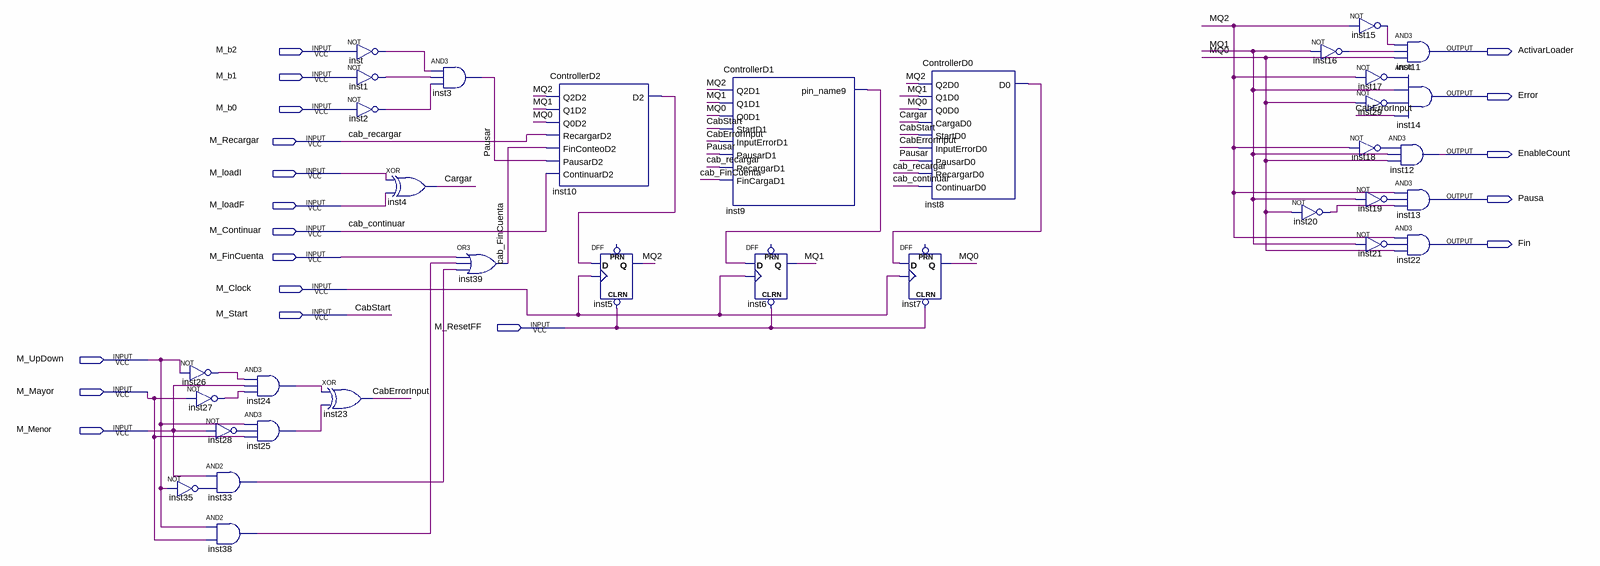
[diagram p0: schematic sheet]
// Quartus schematic ModuloControlador.bdf as structural Verilog: 34 symbols, 19 pins
module ModuloControlador (
  input  M_b2,
  input  M_b1,
  input  M_b0,
  input  M_Recargar,
  input  M_loadI,
  input  M_loadF,
  input  M_Continuar,
  input  M_FinCuenta,
  input  M_Clock,
  input  M_Start,
  input  M_ResetFF,
  input  M_UpDown,
  input  M_Mayor,
  input  M_Menor,
  output ActivarLoader,
  output Error,
  output EnableCount,
  output Pausa,
  output Fin
);

  wire cab_FinCuenta, CabErrorInput, Cargar, inst1_out, inst2_out, inst8_d0, inst9_pin_name9, inst10_d2,
       inst15_out, inst16_out, inst17_out, inst18_out, inst19_out, inst20_out, inst21_out, inst24_out,
       inst25_out, inst26_out, inst27_out, inst28_out, inst29_out, inst33_out, inst35_out, inst38_out,
       inst_out, MQ0, MQ1, MQ2, Pausar;

  not inst26 (inst26_out, M_UpDown);
  not inst27 (inst27_out, M_Mayor);
  not inst28 (inst28_out, M_Menor);
  and inst33 (inst33_out, M_Menor, inst35_out);
  not inst35 (inst35_out, M_UpDown);
  and inst38 (inst38_out, M_UpDown, M_Mayor);
  and inst24 (inst24_out, inst26_out, M_Menor, inst27_out);
  and inst25 (inst25_out, M_UpDown, inst28_out, M_Mayor);
  not inst (inst_out, M_b2);
  not inst1 (inst1_out, M_b1);
  not inst2 (inst2_out, M_b0);
  xor inst23 (CabErrorInput, inst24_out, inst25_out);
  xor inst4 (Cargar, M_loadI, M_loadF);
  and inst3 (Pausar, inst_out, inst1_out, inst2_out);
  or inst39 (cab_FinCuenta, M_FinCuenta, inst38_out, inst33_out);
  ControllerD2 inst10 (
    .Q2D2(MQ2), .Q1D2(MQ1), .Q0D2(MQ0), .RecargarD2(M_Recargar), .FinConteoD2(cab_FinCuenta),
    .PausarD2(Pausar), .ContinuarD2(M_Continuar), .D2(inst10_d2));
  DFF inst5 (.CLRN(M_ResetFF), .CLK(M_Clock), .D(inst10_d2), .Q(MQ2));  // open: PRN
  ControllerD1 inst9 (
    .Q2D1(MQ2), .Q1D1(MQ1), .Q0D1(MQ0), .StartD1(M_Start), .InputErrorD1(CabErrorInput), .PausarD1(Pausar),
    .RecargarD1(M_Recargar), .FinCargaD1(cab_FinCuenta), .pin_name9(inst9_pin_name9));
  DFF inst6 (.CLRN(M_ResetFF), .CLK(M_Clock), .D(inst9_pin_name9), .Q(MQ1));  // open: PRN
  ControllerD0 inst8 (
    .Q2D0(MQ2), .Q1D0(MQ1), .Q0D0(MQ0), .CargaD0(Cargar), .StartD0(M_Start), .InputErrorD0(CabErrorInput),
    .PausarD0(Pausar), .RecargarD0(M_Recargar), .ContinuarD0(M_Continuar), .D0(inst8_d0));
  DFF inst7 (.CLRN(M_ResetFF), .CLK(M_Clock), .D(inst8_d0), .Q(MQ0));  // open: PRN
  not inst20 (inst20_out, MQ0);
  not inst16 (inst16_out, MQ1);
  not inst15 (inst15_out, MQ2);
  and inst11 (ActivarLoader, inst15_out, inst16_out, MQ0);
  and inst14 (Error, inst17_out, MQ1, inst29_out, CabErrorInput);
  not inst17 (inst17_out, MQ2);
  not inst29 (inst29_out, MQ0);
  and inst12 (EnableCount, inst18_out, MQ1, MQ0);
  not inst18 (inst18_out, MQ2);
  and inst13 (Pausa, MQ2, inst19_out, inst20_out);
  not inst19 (inst19_out, MQ1);
  and inst22 (Fin, MQ2, inst21_out, MQ0);
  not inst21 (inst21_out, MQ1);

  // Other names for the same wires on the sheet: cab_continuar = M_Continuar; cab_recargar = M_Recargar;
  //   CabStart = M_Start
endmodule
